# Altium schematic sheet DAC.SchDoc
size 254 x 241 mm; SheetNumber: 8; SheetTotal: 9
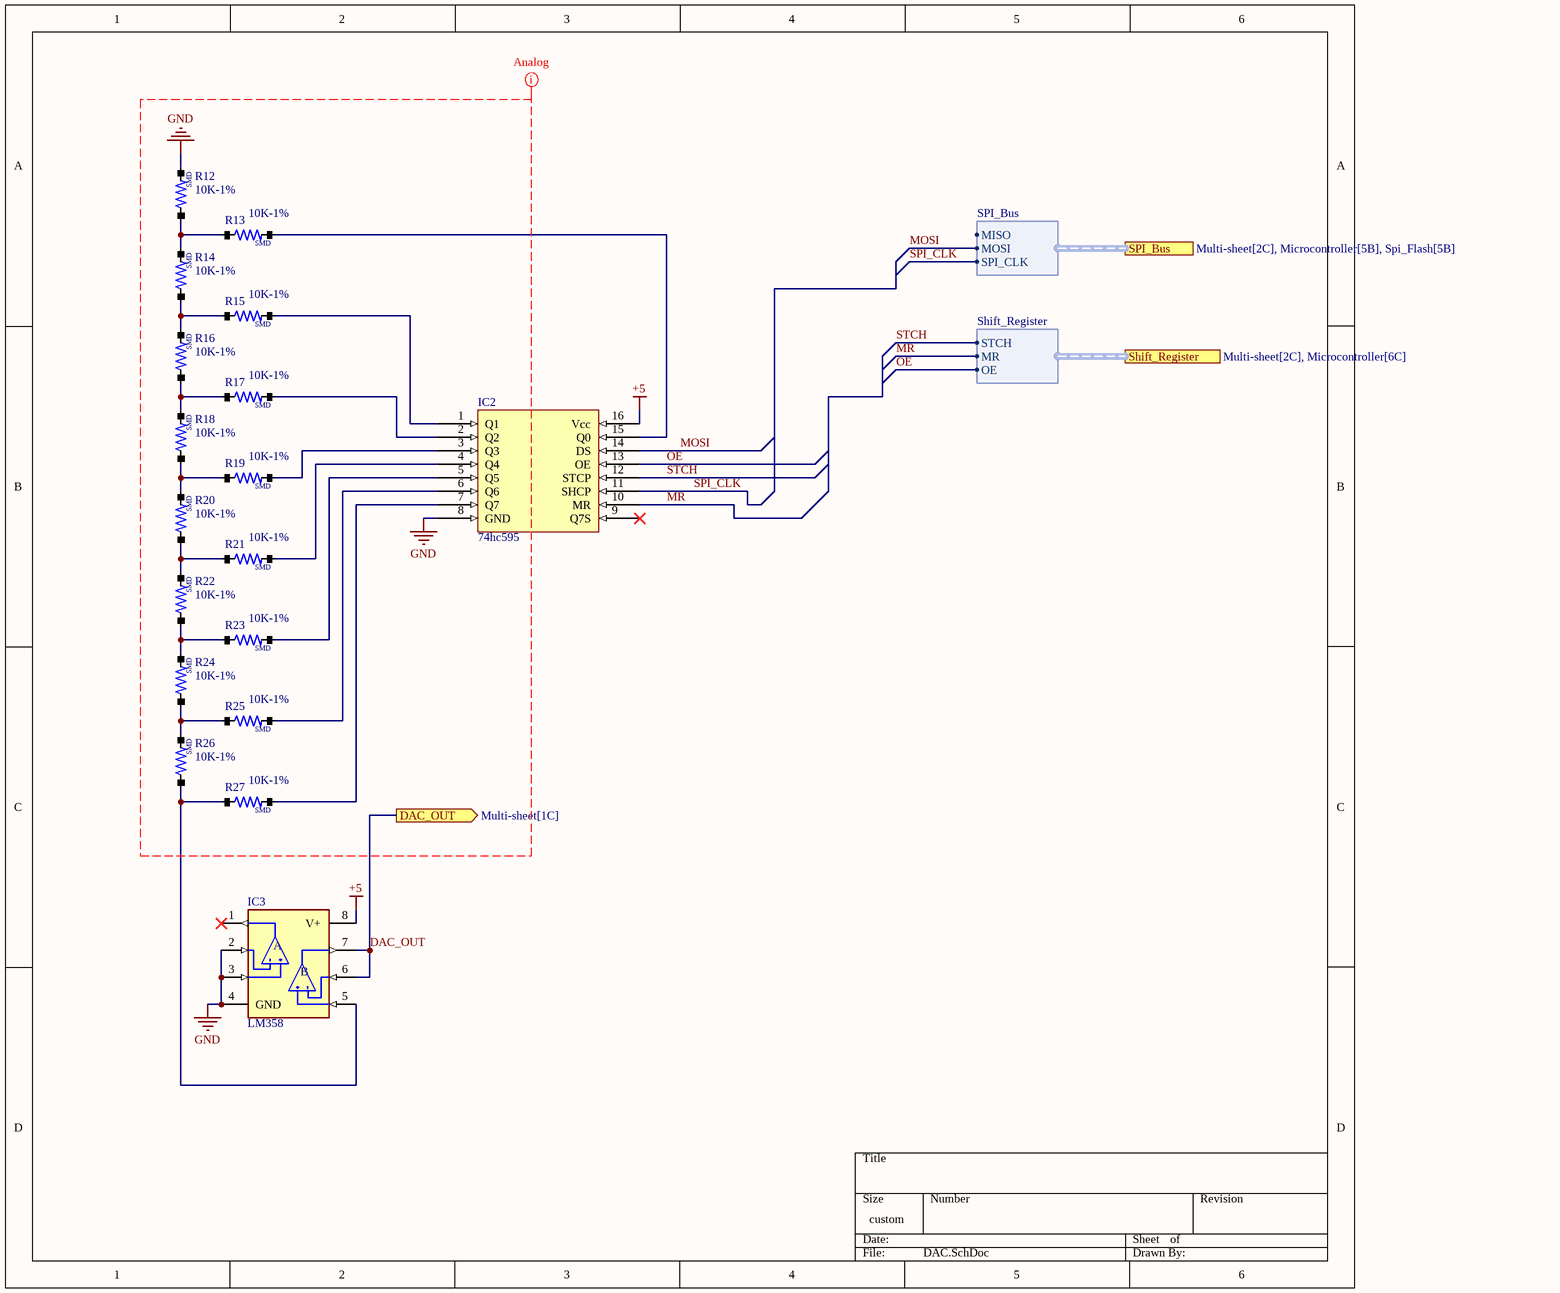
[diagram p0: DAC.SchDoc]

## Parts
IC2  74hc595  [SOP16]
IC3  LM358  [SOP-8]
R12  10K-1%  [RES/0603]
R13  10K-1%  [RES/0603]
R14  10K-1%  [RES/0603]
R15  10K-1%  [RES/0603]
R16  10K-1%  [RES/0603]
R17  10K-1%  [RES/0603]
R18  10K-1%  [RES/0603]
R19  10K-1%  [RES/0603]
R20  10K-1%  [RES/0603]
R21  10K-1%  [RES/0603]
R22  10K-1%  [RES/0603]
R23  10K-1%  [RES/0603]
R24  10K-1%  [RES/0603]
R25  10K-1%  [RES/0603]
R26  10K-1%  [RES/0603]
R27  10K-1%  [RES/0603]

## Ports
DAC_OUT (out, see Multi-sheet[1C]), Shift_Register (harness Shift_Register, see Multi-sheet[2C], Microcontroller[6C]), SPI_Bus (harness SPI_Bus, see Multi-sheet[2C], Microcontroller[5B], Spi_Flash[5B])

## Harnesses
SPI_Bus: MISO, MOSI, SPI_CLK
Shift_Register: STCH, MR, OE

## Nets
+5: IC2.16(Vcc) IC3.8(V+)
GND: IC2.8(GND) IC3.2(-INA) IC3.3(+INA) IC3.4(GND) R12.2
DAC_OUT: IC3.6(-INB) IC3.7(OUTB) ; port DAC_OUT
MOSI: IC2.14(DS) ; port SPI_Bus.MOSI
MR: IC2.10(MR) ; port Shift_Register.MR
OE: IC2.13(OE) ; port Shift_Register.OE
SPI_CLK: IC2.11(SHCP) ; port SPI_Bus.SPI_CLK
STCH: IC2.12(STCP) ; port Shift_Register.STCH
NetIC2_1: IC2.1(Q1) R15.2
NetIC2_2: IC2.2(Q2) R17.2
NetIC2_3: IC2.3(Q3) R19.2
NetIC2_4: IC2.4(Q4) R21.2
NetIC2_5: IC2.5(Q5) R23.2
NetIC2_6: IC2.6(Q6) R25.2
NetIC2_7: IC2.7(Q7) R27.2
NetIC2_15: IC2.15(Q0) R13.2
NetIC3_5: IC3.5(+INB) R26.1 R27.1
NetR12_1: R12.1 R13.1 R14.2
NetR14_1: R14.1 R15.1 R16.2
NetR16_1: R16.1 R17.1 R18.2
NetR18_1: R18.1 R19.1 R20.2
NetR20_1: R20.1 R21.1 R22.2
NetR22_1: R22.1 R23.1 R24.2
NetR24_1: R24.1 R25.1 R26.2

Not connected (* = marked no-connect by the designer): IC2 9(Q7S)*; IC3 1(OUTA)*

## Layout directives
net class Analog: GND

## Notes on the sheet
- (in symbol LM358) A; B
- (in symbol RES/SMD) SMD

## Library data of the parts
R12-R27 = RES/SMD